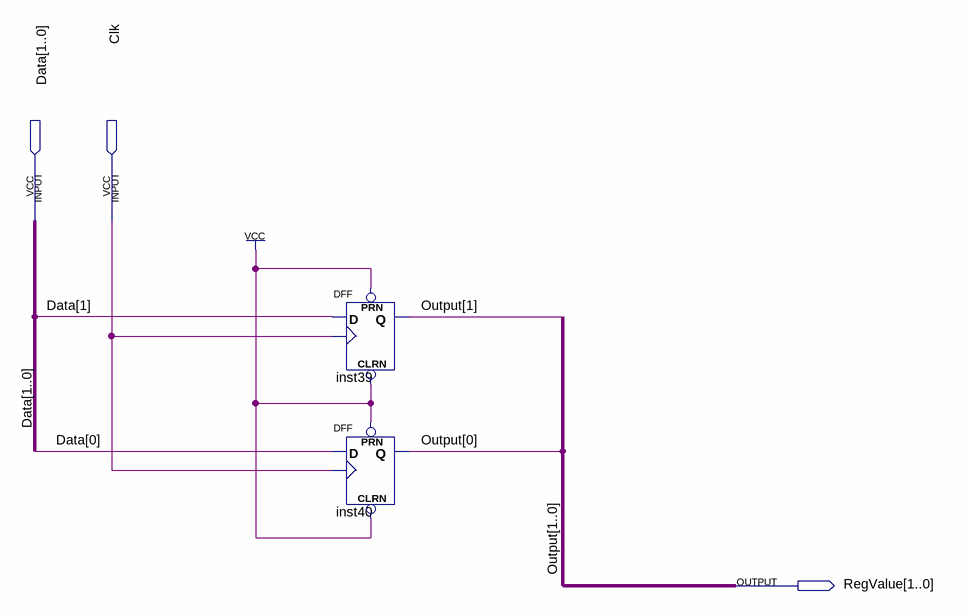
[diagram p0: schematic sheet]
// Quartus schematic Register_2bits.bdf as structural Verilog: 2 symbols, 3 pins
module Register_2bits (
  input  [1:0] Data,
  input  Clk,
  output [1:0] RegValue
);

  DFF inst39 (.CLRN(1'b1), .CLK(Clk), .D(Data[1]), .PRN(1'b1), .Q(RegValue[1]));
  DFF inst40 (.CLRN(1'b1), .CLK(Clk), .D(Data[0]), .PRN(1'b1), .Q(RegValue[0]));

  // Other names for the same wires on the sheet: Output[1:0] = RegValue
endmodule
